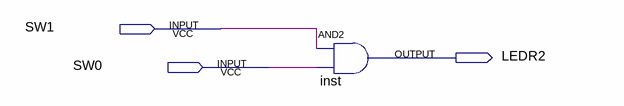
[diagram p0: schematic sheet]
// Quartus schematic Opdracht1.bdf as structural Verilog: 1 symbols, 3 pins
module Opdracht1 (
  input  SW1,
  input  SW0,
  output LEDR2
);

  and inst (LEDR2, SW1, SW0);
endmodule
